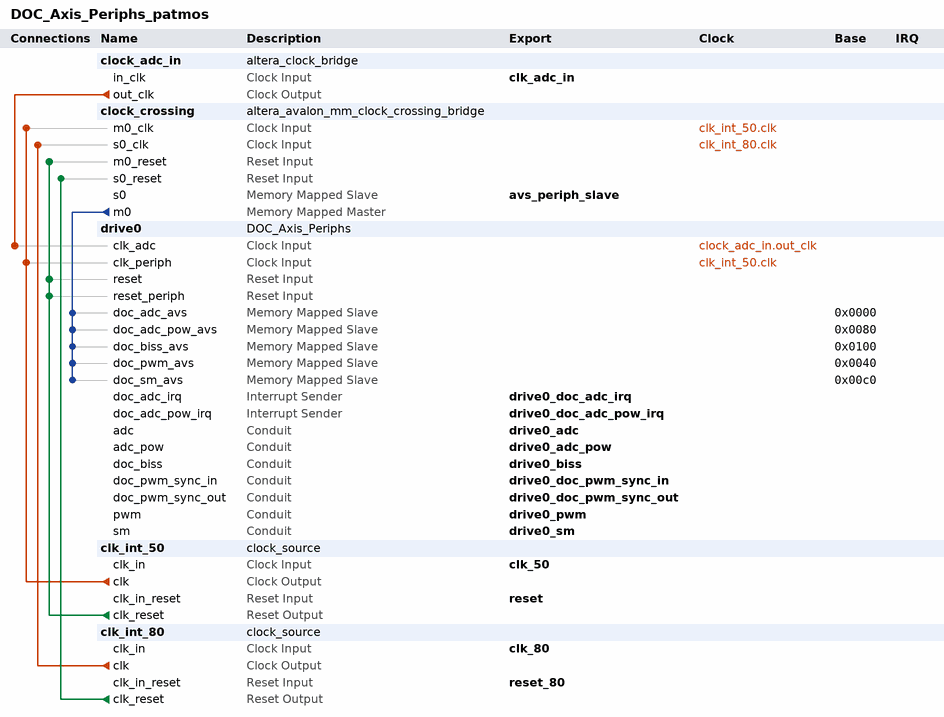
[diagram p0: system contents]
# Platform Designer (Qsys) system DOC_Axis_Periphs_patmos, Cyclone IV E EP4CE115F29C7
# Parameters at their usual value, and those the tool derives, are not listed.
package require -exact qsys 14.0
create_system DOC_Axis_Periphs_patmos
set_project_property DEVICE_FAMILY {Cyclone IV E}
set_project_property DEVICE EP4CE115F29C7

add_instance clock_adc_in altera_clock_bridge 14.0
set_instance_parameter_value clock_adc_in DERIVED_CLOCK_RATE 0
set_instance_parameter_value clock_adc_in EXPLICIT_CLOCK_RATE 20

add_instance clock_crossing altera_avalon_mm_clock_crossing_bridge 14.0
set_instance_parameter_value clock_crossing DATA_WIDTH 32
set_instance_parameter_value clock_crossing ADDRESS_WIDTH 12
set_instance_parameter_value clock_crossing USE_AUTO_ADDRESS_WIDTH 0
set_instance_parameter_value clock_crossing MAX_BURST_SIZE 1
set_instance_parameter_value clock_crossing COMMAND_FIFO_DEPTH 2
set_instance_parameter_value clock_crossing RESPONSE_FIFO_DEPTH 2
set_instance_parameter_value clock_crossing MASTER_SYNC_DEPTH 3
set_instance_parameter_value clock_crossing SLAVE_SYNC_DEPTH 3

add_instance drive0 DOC_Axis_Periphs 1.0

add_instance clk_int_50 clock_source 14.0
set_instance_parameter_value clk_int_50 clockFrequency 50000000

add_instance clk_int_80 clock_source 14.0
set_instance_parameter_value clk_int_80 clockFrequency 80000000

# connections
add_connection clk_int_50.clk clock_crossing.m0_clk clock
add_connection clk_int_50.clk drive0.clk_periph clock
add_connection clk_int_80.clk clock_crossing.s0_clk clock
add_connection clock_adc_in.out_clk drive0.clk_adc clock
add_connection clk_int_50.clk_reset clock_crossing.m0_reset reset
add_connection clk_int_50.clk_reset drive0.reset reset
add_connection clk_int_50.clk_reset drive0.reset_periph reset
add_connection clk_int_80.clk_reset clock_crossing.s0_reset reset
add_connection clock_crossing.m0 drive0.doc_adc_avs avalon
set_connection_parameter_value clock_crossing.m0/drive0.doc_adc_avs baseAddress 0x0000
add_connection clock_crossing.m0 drive0.doc_adc_pow_avs avalon
set_connection_parameter_value clock_crossing.m0/drive0.doc_adc_pow_avs baseAddress 0x0080
add_connection clock_crossing.m0 drive0.doc_biss_avs avalon
set_connection_parameter_value clock_crossing.m0/drive0.doc_biss_avs baseAddress 0x0100
add_connection clock_crossing.m0 drive0.doc_pwm_avs avalon
set_connection_parameter_value clock_crossing.m0/drive0.doc_pwm_avs baseAddress 0x0040
add_connection clock_crossing.m0 drive0.doc_sm_avs avalon
set_connection_parameter_value clock_crossing.m0/drive0.doc_sm_avs baseAddress 0x00c0

# exported interfaces
add_interface drive0_adc conduit end
set_interface_property drive0_adc EXPORT_OF drive0.adc
add_interface drive0_pwm conduit end
set_interface_property drive0_pwm EXPORT_OF drive0.pwm
add_interface drive0_sm conduit end
set_interface_property drive0_sm EXPORT_OF drive0.sm
add_interface drive0_adc_pow conduit end
set_interface_property drive0_adc_pow EXPORT_OF drive0.adc_pow
add_interface clk_adc_in clock sink
set_interface_property clk_adc_in EXPORT_OF clock_adc_in.in_clk
add_interface drive0_biss conduit end
set_interface_property drive0_biss EXPORT_OF drive0.doc_biss
add_interface drive0_doc_pwm_sync_out conduit end
set_interface_property drive0_doc_pwm_sync_out EXPORT_OF drive0.doc_pwm_sync_out
add_interface drive0_doc_pwm_sync_in conduit end
set_interface_property drive0_doc_pwm_sync_in EXPORT_OF drive0.doc_pwm_sync_in
add_interface drive0_doc_adc_irq interrupt sender
set_interface_property drive0_doc_adc_irq EXPORT_OF drive0.doc_adc_irq
add_interface drive0_doc_adc_pow_irq interrupt sender
set_interface_property drive0_doc_adc_pow_irq EXPORT_OF drive0.doc_adc_pow_irq
add_interface avs_periph_slave avalon slave
set_interface_property avs_periph_slave EXPORT_OF clock_crossing.s0
add_interface reset reset sink
set_interface_property reset EXPORT_OF clk_int_50.clk_in_reset
add_interface clk_50 clock sink
set_interface_property clk_50 EXPORT_OF clk_int_50.clk_in
add_interface clk_80 clock sink
set_interface_property clk_80 EXPORT_OF clk_int_80.clk_in
add_interface reset_80 reset sink
set_interface_property reset_80 EXPORT_OF clk_int_80.clk_in_reset

set_interconnect_requirement {$system} qsys_mm.clockCrossingAdapter HANDSHAKE
set_interconnect_requirement {$system} qsys_mm.maxAdditionalLatency 0

save_system DOC_Axis_Periphs_patmos.qsys
